# EAGLE design cert3d_rev1 (EAGLE 9.3.2)
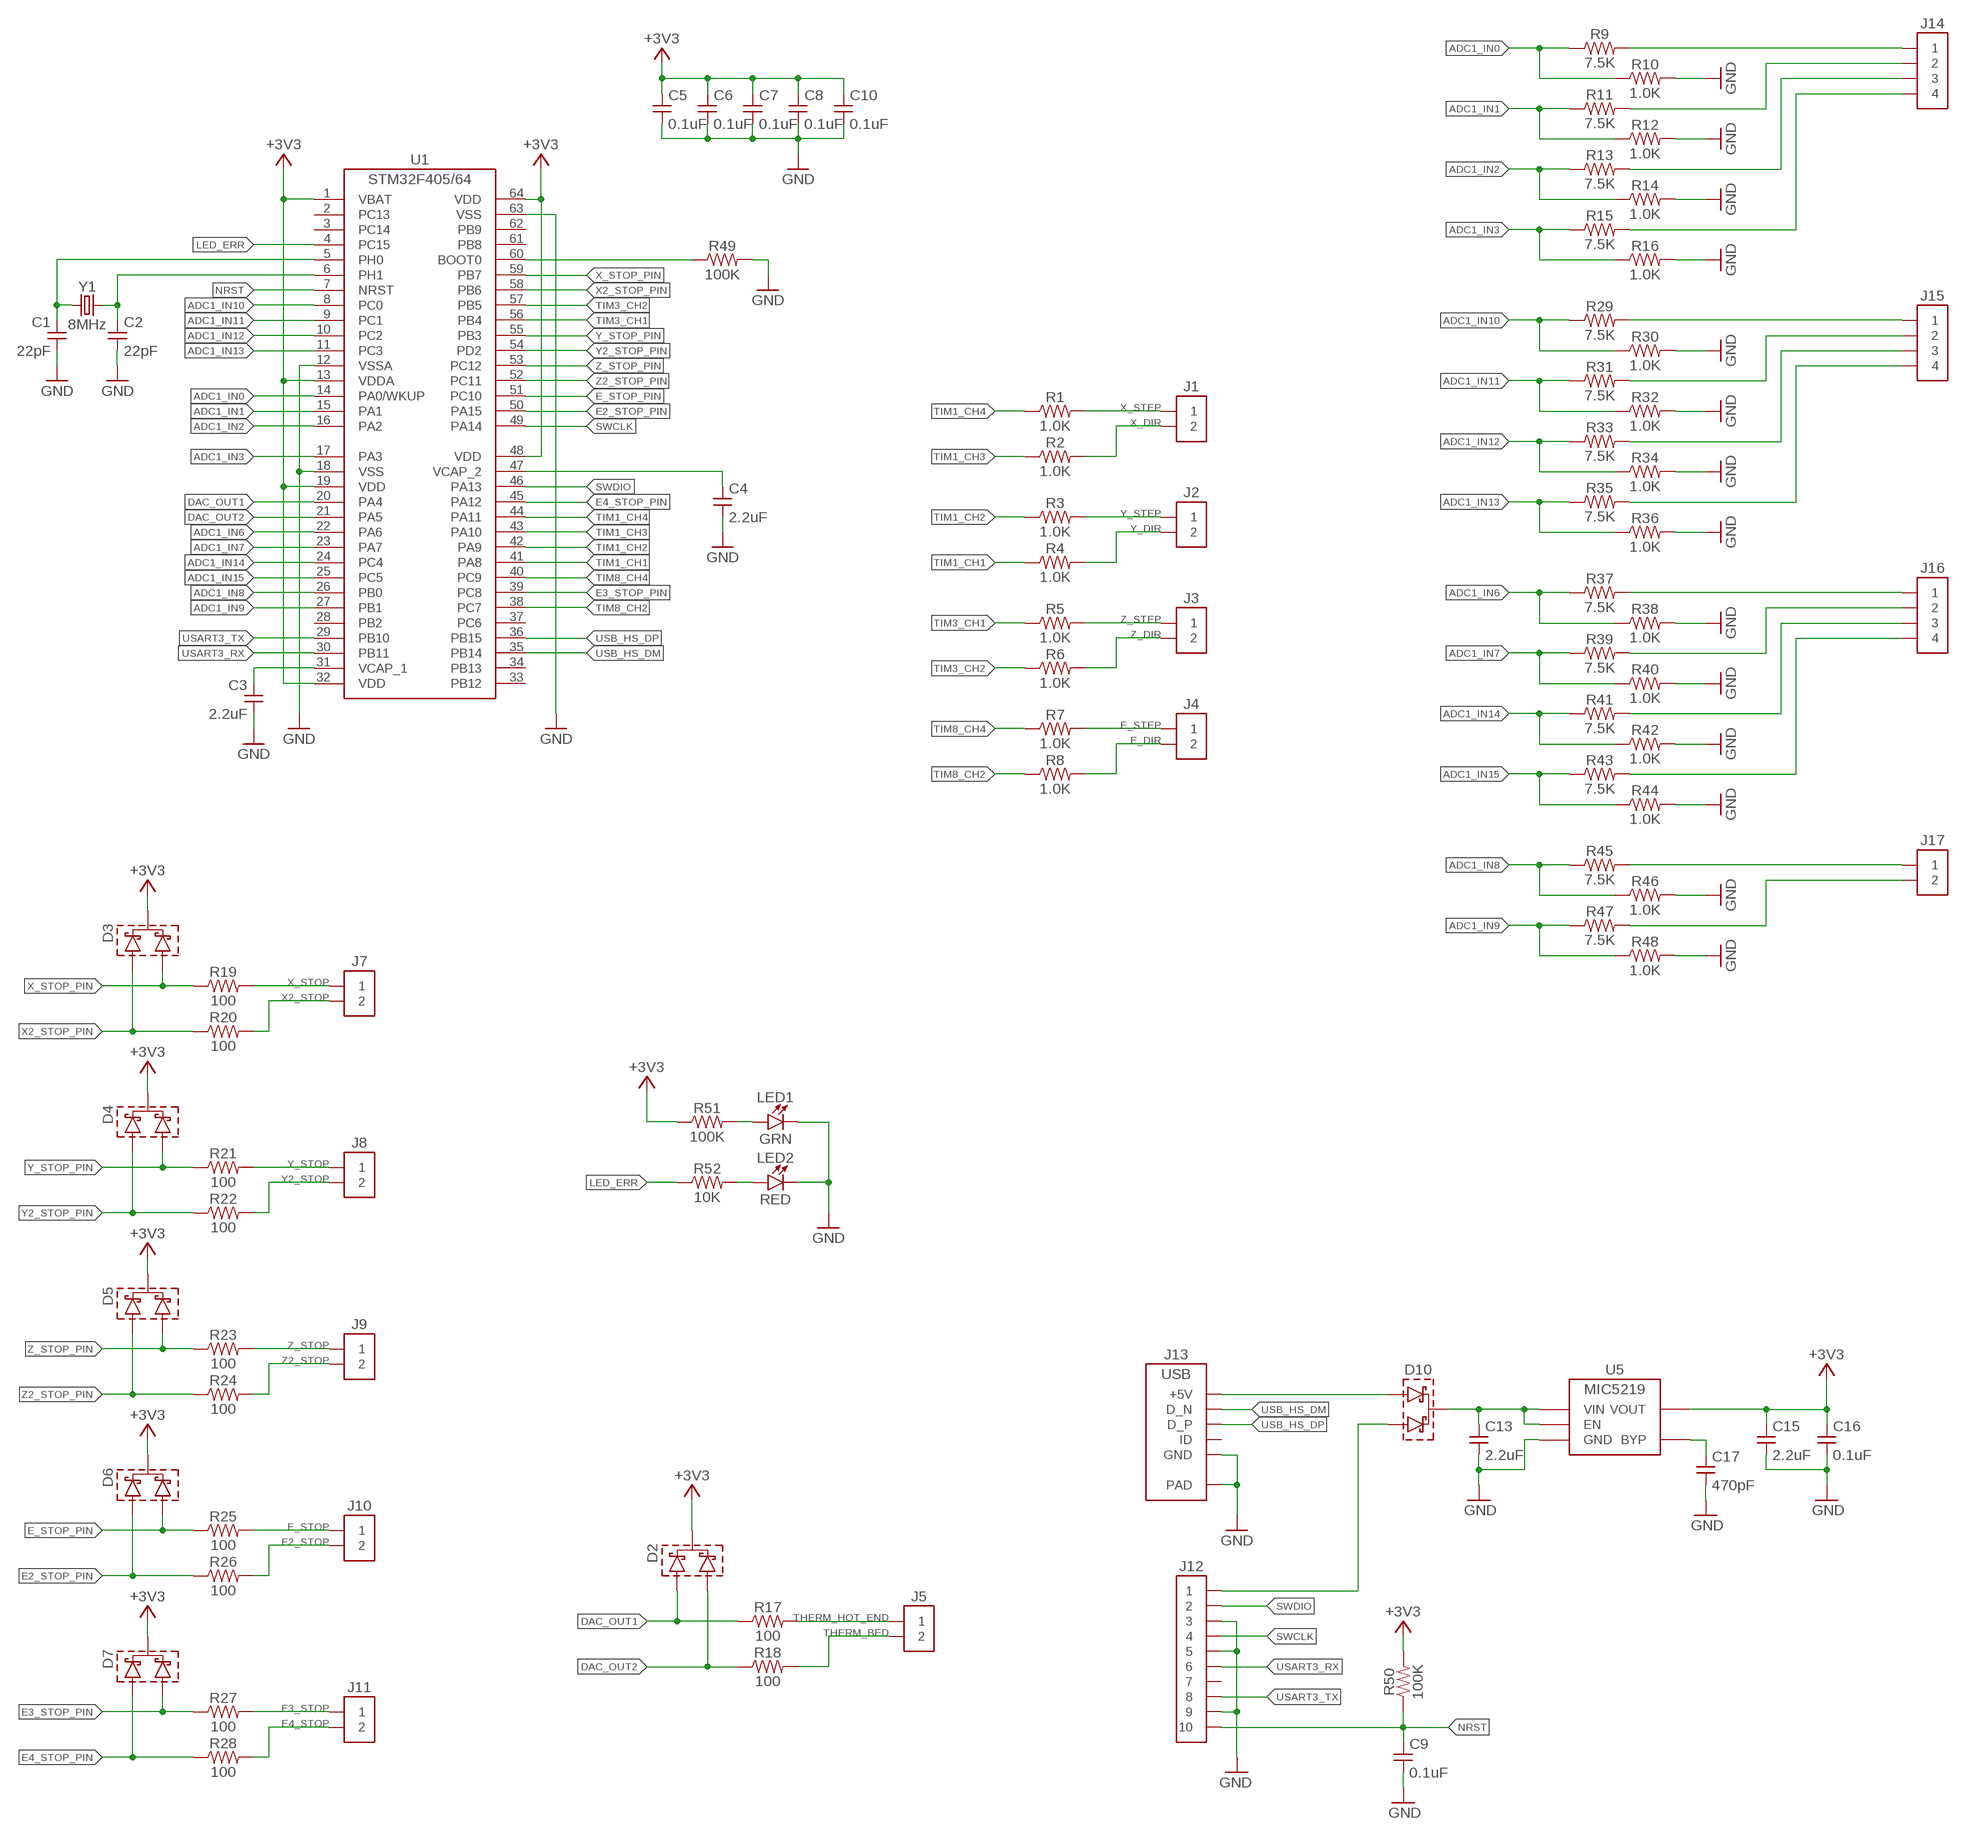
[diagram p0: schematic, sheet 1]

## Parts
C1  22pF  C_USC0805-5MIL  [C0805-5MIL]
C2  22pF  C_USC0805-5MIL  [C0805-5MIL]
C3  2.2uF  C_USC0805-5MIL  [C0805-5MIL]
C4  2.2uF  C_USC0805-5MIL  [C0805-5MIL]
C5  0.1uF  C_USC0805-5MIL  [C0805-5MIL]
C6  0.1uF  C_USC0805-5MIL  [C0805-5MIL]
C7  0.1uF  C_USC0805-5MIL  [C0805-5MIL]
C8  0.1uF  C_USC0805-5MIL  [C0805-5MIL]
C9  0.1uF  C_USC0805-5MIL  [C0805-5MIL]
C10  0.1uF  C_USC0805-5MIL  [C0805-5MIL]
C13  2.2uF  C_USC0805-5MIL  [C0805-5MIL]
C15  2.2uF  C_USC0805-5MIL  [C0805-5MIL]
C16  0.1uF  C_USC0805-5MIL  [C0805-5MIL]
C17  470pF  C_USC0805-5MIL  [C0805-5MIL]
D2  SCHOTTKY_DUAL_CCBAT54C  [SOT23-3]
D3  SCHOTTKY_DUAL_CCBAT54C  [SOT23-3]
D4  SCHOTTKY_DUAL_CCBAT54C  [SOT23-3]
D5  SCHOTTKY_DUAL_CCBAT54C  [SOT23-3]
D6  SCHOTTKY_DUAL_CCBAT54C  [SOT23-3]
D7  SCHOTTKY_DUAL_CCBAT54C  [SOT23-3]
D10  SCHOTTKY_DUAL_CCBAT54C  [SOT23-3]
J1  CONN2TSW-S  [SAM-TSW-102-XX-X-S]
J2  CONN2TSW-S  [SAM-TSW-102-XX-X-S]
J3  CONN2TSW-S  [SAM-TSW-102-XX-X-S]
J4  CONN2TSW-S  [SAM-TSW-102-XX-X-S]
J5  CONN2TSW-S  [SAM-TSW-102-XX-X-S]
J7  CONN2TSW-S  [SAM-TSW-102-XX-X-S]
J8  CONN2TSW-S  [SAM-TSW-102-XX-X-S]
J9  CONN2TSW-S  [SAM-TSW-102-XX-X-S]
J10  CONN2TSW-S  [SAM-TSW-102-XX-X-S]
J11  CONN2TSW-S  [SAM-TSW-102-XX-X-S]
J12  CONN10CNC-3220-10-0100-00  [CNC-3220-10-0100-00]
J13  USB-5PINTOPVIA  [HIR-ZX62R-B-5P-VIAS]
J14  CONN4TSW-S  [SAM-TSW-104-XX-X-S]
J15  CONN4TSW-S  [SAM-TSW-104-XX-X-S]
J16  CONN4TSW-S  [SAM-TSW-104-XX-X-S]
J17  CONN2TSW-S  [SAM-TSW-102-XX-X-S]
LED1  GRN  LEDCHIPLED0805-SMALL  [CHIPLED0805-SMALL]
LED2  RED  LEDCHIPLED0805-SMALL  [CHIPLED0805-SMALL]
R1  1.0K  R_US0805R  [RES0805R]
R2  1.0K  R_US0805R  [RES0805R]
R3  1.0K  R_US0805R  [RES0805R]
R4  1.0K  R_US0805R  [RES0805R]
R5  1.0K  R_US0805R  [RES0805R]
R6  1.0K  R_US0805R  [RES0805R]
R7  1.0K  R_US0805R  [RES0805R]
R8  1.0K  R_US0805R  [RES0805R]
R9  7.5K  R_USRES0805-5MIL  [RES0805R-5MIL]
R10  1.0K  R_USRES0805-5MIL  [RES0805R-5MIL]
R11  7.5K  R_USRES0805-5MIL  [RES0805R-5MIL]
R12  1.0K  R_USRES0805-5MIL  [RES0805R-5MIL]
R13  7.5K  R_USRES0805-5MIL  [RES0805R-5MIL]
R14  1.0K  R_USRES0805-5MIL  [RES0805R-5MIL]
R15  7.5K  R_USRES0805-5MIL  [RES0805R-5MIL]
R16  1.0K  R_USRES0805-5MIL  [RES0805R-5MIL]
R17  100  R_USRES0805-5MIL  [RES0805R-5MIL]
R18  100  R_USRES0805-5MIL  [RES0805R-5MIL]
R19  100  R_USRES0805-5MIL  [RES0805R-5MIL]
R20  100  R_USRES0805-5MIL  [RES0805R-5MIL]
R21  100  R_USRES0805-5MIL  [RES0805R-5MIL]
R22  100  R_USRES0805-5MIL  [RES0805R-5MIL]
R23  100  R_USRES0805-5MIL  [RES0805R-5MIL]
R24  100  R_USRES0805-5MIL  [RES0805R-5MIL]
R25  100  R_USRES0805-5MIL  [RES0805R-5MIL]
R26  100  R_USRES0805-5MIL  [RES0805R-5MIL]
R27  100  R_USRES0805-5MIL  [RES0805R-5MIL]
R28  100  R_USRES0805-5MIL  [RES0805R-5MIL]
R29  7.5K  R_USRES0805-5MIL  [RES0805R-5MIL]
R30  1.0K  R_USRES0805-5MIL  [RES0805R-5MIL]
R31  7.5K  R_USRES0805-5MIL  [RES0805R-5MIL]
R32  1.0K  R_USRES0805-5MIL  [RES0805R-5MIL]
R33  7.5K  R_USRES0805-5MIL  [RES0805R-5MIL]
R34  1.0K  R_USRES0805-5MIL  [RES0805R-5MIL]
R35  7.5K  R_USRES0805-5MIL  [RES0805R-5MIL]
R36  1.0K  R_USRES0805-5MIL  [RES0805R-5MIL]
R37  7.5K  R_USRES0805-5MIL  [RES0805R-5MIL]
R38  1.0K  R_USRES0805-5MIL  [RES0805R-5MIL]
R39  7.5K  R_USRES0805-5MIL  [RES0805R-5MIL]
R40  1.0K  R_USRES0805-5MIL  [RES0805R-5MIL]
R41  7.5K  R_USRES0805-5MIL  [RES0805R-5MIL]
R42  1.0K  R_USRES0805-5MIL  [RES0805R-5MIL]
R43  7.5K  R_USRES0805-5MIL  [RES0805R-5MIL]
R44  1.0K  R_USRES0805-5MIL  [RES0805R-5MIL]
R45  7.5K  R_USRES0805-5MIL  [RES0805R-5MIL]
R46  1.0K  R_USRES0805-5MIL  [RES0805R-5MIL]
R47  7.5K  R_USRES0805-5MIL  [RES0805R-5MIL]
R48  1.0K  R_USRES0805-5MIL  [RES0805R-5MIL]
R49  100K  R_USRES0805-5MIL  [RES0805R-5MIL]
R50  100K  R_USRES0805-5MIL  [RES0805R-5MIL]
R51  100K  R_USRES0805-5MIL  [RES0805R-5MIL]
R52  10K  R_USRES0805-5MIL  [RES0805R-5MIL]
U1  STM32F405/64  [LQFP64-10X10MM]
U5  MIC5219  [SOT23-5]
Y1  8MHz  CRYSTALHC49US  [HC49US]

## Nets
+3V3: C5.1 C6.1 C7.1 C8.1 C10.1 C15.1 C16.1 D2.3(C) D3.3(C) D4.3(C) D5.3(C) D6.3(C) D7.3(C) R50.2 R51.1 U1.1(VBAT) U1.13(VDDA) U1.19(VDD) U1.32(VDD) U1.48(VDD) U1.64(VDD) U5.5(VOUT)
ADC1_IN0: R9.1 R10.1 U1.14(PA0/WKUP)
ADC1_IN1: R11.1 R12.1 U1.15(PA1)
ADC1_IN2: R13.1 R14.1 U1.16(PA2)
ADC1_IN3: R15.1 R16.1 U1.17(PA3)
ADC1_IN6: R37.1 R38.1 U1.22(PA6)
ADC1_IN7: R39.1 R40.1 U1.23(PA7)
ADC1_IN8: R45.1 R46.1 U1.26(PB0)
ADC1_IN9: R47.1 R48.1 U1.27(PB1)
ADC1_IN10: R29.1 R30.1 U1.8(PC0)
ADC1_IN11: R31.1 R32.1 U1.9(PC1)
ADC1_IN12: R33.1 R34.1 U1.10(PC2)
ADC1_IN13: R35.1 R36.1 U1.11(PC3)
ADC1_IN14: R41.1 R42.1 U1.24(PC4)
ADC1_IN15: R43.1 R44.1 U1.25(PC5)
DAC_OUT1: D2.1(A1) R17.1 U1.20(PA4)
DAC_OUT2: D2.2(A2) R18.1 U1.21(PA5)
E2_STOP: J10.2 R26.2
E2_STOP_PIN: D6.1(A1) R26.1 U1.50(PA15)
E3_STOP: J11.1 R27.2
E3_STOP_PIN: D7.2(A2) R27.1 U1.39(PC8)
E4_STOP: J11.2 R28.2
E4_STOP_PIN: D7.1(A1) R28.1 U1.45(PA12)
E_DIR: J4.2 R8.2
E_STEP: J4.1 R7.2
E_STOP: J10.1 R25.2
E_STOP_PIN: D6.2(A2) R25.1 U1.51(PC10)
GND: C1.2 C2.2 C3.2 C4.2 C5.2 C6.2 C7.2 C8.2 C9.2 C10.2 C13.2 C15.2 C16.2 C17.2 J12.3 J12.5 J12.9 J13.5(GND) J13.PAD@1(PAD) J13.PAD@2(PAD) J13.PAD@3(PAD) J13.PAD@4(PAD) J13.PAD@5(PAD) J13.PAD@6(PAD) J13.PAD@7(PAD) J13.PAD@8(PAD) J13.PAD@9(PAD) J13.PAD@10(PAD) J13.PAD@11(PAD) J13.PAD@12(PAD) LED1.C LED2.C R10.2 R12.2 R14.2 R16.2 R30.2 R32.2 R34.2 R36.2 R38.2 R40.2 R42.2 R44.2 R46.2 R48.2 R49.2 U1.12(VSSA) U1.18(VSS) U1.63(VSS) U5.2(GND)
LED_ERR: R52.1 U1.4(PC15)
N$1: C2.1 U1.6(PH1) Y1.2
N$2: C1.1 U1.5(PH0) Y1.1
N$3: J14.2 R11.2
N$4: C4.1 U1.47(VCAP_2)
N$5: J14.1 R9.2
N$6: C3.1 U1.31(VCAP_1)
N$7: J14.3 R13.2
N$8: J14.4 R15.2
N$9: D10.2(A2) J12.1
N$10: C13.1 D10.3(C) U5.1(VIN) U5.3(EN)
N$11: J15.1 R29.2
N$12: D10.1(A1) J13.1(+5V)
N$13: J15.2 R31.2
N$14: J15.3 R33.2
N$15: J15.4 R35.2
N$16: J16.1 R37.2
N$17: J16.2 R39.2
N$18: J16.3 R41.2
N$19: J16.4 R43.2
N$20: J17.1 R45.2
N$21: J17.2 R47.2
N$22: R49.1 U1.60(BOOT0)
N$23: LED2.A R52.2
N$24: LED1.A R51.2
N$33: C17.1 U5.4(BYP)
NRST: C9.1 J12.10 R50.1 U1.7(NRST)
SWCLK: J12.4 U1.49(PA14)
SWDIO: J12.2 U1.46(PA13)
THERM_BED: J5.2 R18.2
THERM_HOT_END: J5.1 R17.2
TIM1_CH1: R4.1 U1.41(PA8)
TIM1_CH2: R3.1 U1.42(PA9)
TIM1_CH3: R2.1 U1.43(PA10)
TIM1_CH4: R1.1 U1.44(PA11)
TIM3_CH1: R5.1 U1.56(PB4)
TIM3_CH2: R6.1 U1.57(PB5)
TIM8_CH2: R8.1 U1.38(PC7)
TIM8_CH4: R7.1 U1.40(PC9)
USART3_RX: J12.6 U1.30(PB11)
USART3_TX: J12.8 U1.29(PB10)
USB_HS_DM: J13.2(D_N) U1.35(PB14)
USB_HS_DP: J13.3(D_P) U1.36(PB15)
X2_STOP: J7.2 R20.2
X2_STOP_PIN: D3.1(A1) R20.1 U1.58(PB6)
X_DIR: J1.2 R2.2
X_STEP: J1.1 R1.2
X_STOP: J7.1 R19.2
X_STOP_PIN: D3.2(A2) R19.1 U1.59(PB7)
Y2_STOP: J8.2 R22.2
Y2_STOP_PIN: D4.1(A1) R22.1 U1.54(PD2)
Y_DIR: J2.2 R4.2
Y_STEP: J2.1 R3.2
Y_STOP: J8.1 R21.2
Y_STOP_PIN: D4.2(A2) R21.1 U1.55(PB3)
Z2_STOP: J9.2 R24.2
Z2_STOP_PIN: D5.1(A1) R24.1 U1.52(PC11)
Z_DIR: J3.2 R6.2
Z_STEP: J3.1 R5.2
Z_STOP: J9.1 R23.2
Z_STOP_PIN: D5.2(A2) R23.1 U1.53(PC12)
Unconnected: J12.7 J13.4(ID) U1.2(PC13) U1.3(PC14) U1.28(PB2) U1.33(PB12) U1.34(PB13) U1.37(PC6) U1.61(PB8) U1.62(PB9)

## Library data of the parts
C1 C2 = kcl_passives:C_US; PN: 885012007053
C3 C4 = kcl_passives:C_US; PN: C0805C225K3RAC7800
C5-C10 C16 C17 = kcl_passives:C_US; PN: C0805C104K5RACTU
C13 C15 = kcl_passives:C_US; PN: C0805C225K8RACTU
D2-D7 D10 = kcl_passives:SCHOTTKY_DUAL_CC; PN: BAT54CLT1G
J1-J5 J7-J11 J17 = kcl_connectors_auto:CONN2; PN: TSW-102-07-F-S
J12 = kcl_connectors:CONN10; PN: 3220-10-0100-00
J13 = kcl_connectors:USB-5PIN; PN: ZX62R-B-5P(30)
J14-J16 = kcl_connectors_auto:CONN4; PN: TSW-104-07-F-S
LED1 = kcl_passives:LED; PN: 150080GS75000
LED2 = kcl_passives:LED; PN: 150080RS75000
R1-R8 R10 R12 R14 R16 R30 R32 R34 R36 R38 R40 R42 R44 R46 R48 = kcl_passives:R_US; PN: CRCW08051K00FKEA
R9 R11 R13 R15 R29 R31 R33 R35 R37 R39 R41 R43 R45 R47 = kcl_passives:R_US; PN: CRCW08057K50FKEA
R17-R28 = kcl_passives:R_US; PN: CRCW0805100RFKEA
R49-R51 = kcl_passives:R_US; PN: CRCW0805100KFKEA
R52 = kcl_passives:R_US; PN: CRCW080510K0FKEA
U1 = kcl_ics:STM32F405/64; PN: STM32F405RGT6‎
U5 = kcl_ics:MIC5219; PN: MIC5323-3.3YD5-TR
Y1 = kcl_passives:CRYSTAL: Crystal; PN: FC4STCBMF8.0-BAG200

## Net classes
0 default: width 0.254 mm

## Board
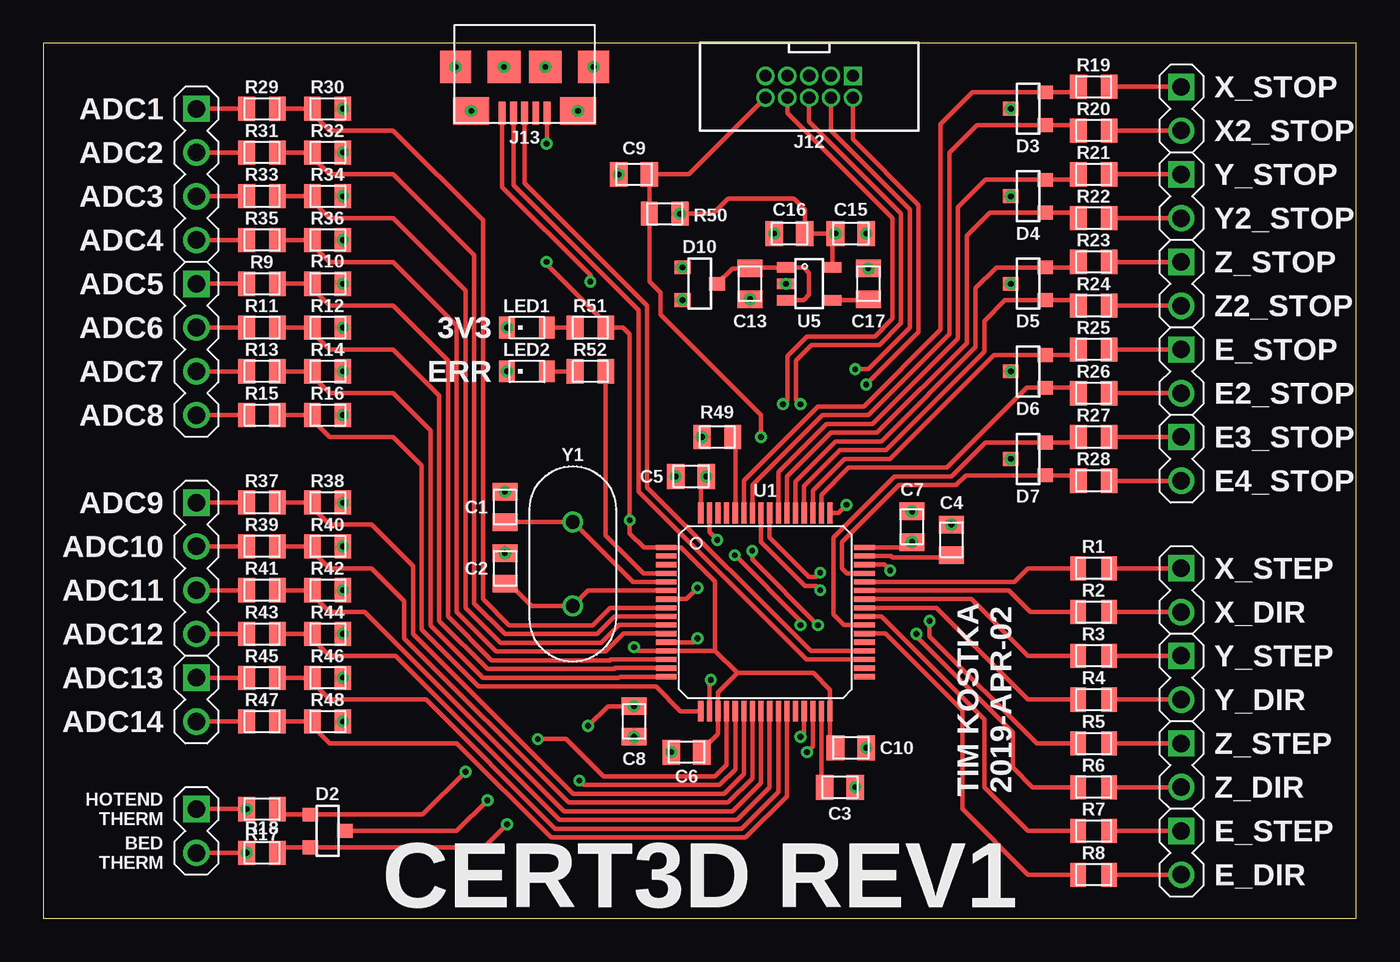
[diagram p1: board, top side]
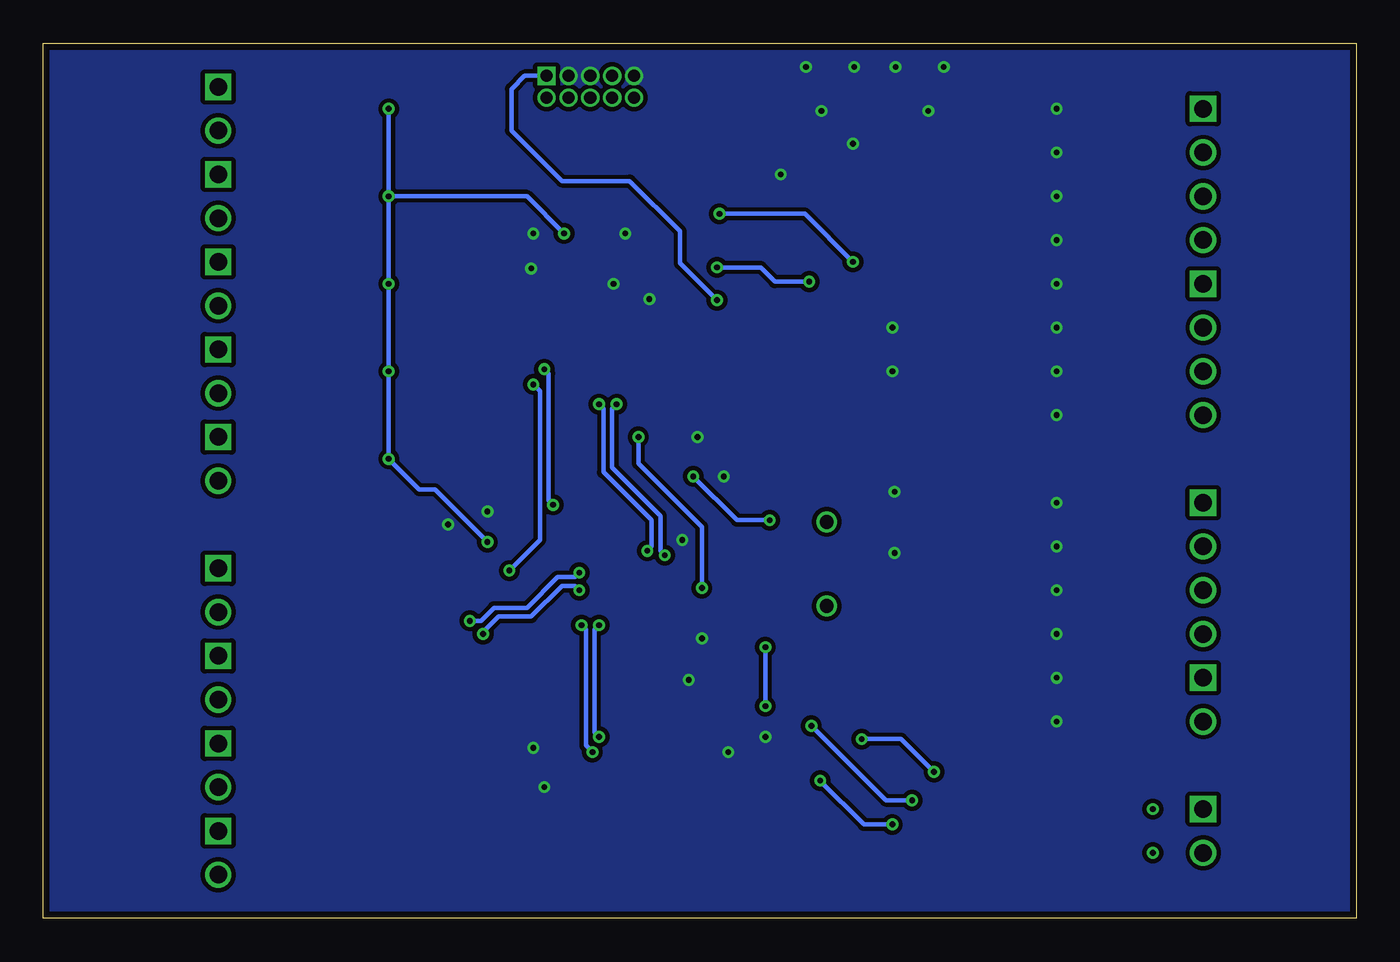
[diagram p2: board, bottom side, seen from below]

Size 76.2 x 50.8 mm. Coordinates in mm from the lower left corner, seen from the top.
Outline: 0,0 76.2,0 76.2,50.8 0,50.8 0,0
Copper layers (1*16): Top 0.0356mm / dielectric 1.5011mm / Bottom 0.0356mm
Design rules "oshpark-2layer *": minimum track width 6mil, minimum drill 13mil, track to track 6mil, track to pad 6mil, pad to pad 6mil, via to via 6mil, smd to smd 6mil, copper to edge 15mil, drill to drill 6mil, minimum pad ring 7mil, minimum via ring 7mil, stop-mask expansion 4mil, vias tented up to drill 13mil, thermal gap 10mil

### Footprints (pad centres in the part's own frame; a part is rotated, then mirrored left to right if it is on the bottom)
C0805-5MIL = smd 1.016 x 1.448: 1 -0.889,0; 2 0.889,0
SOT23-3 = smd 0.9 x 0.8: 1 -1,0.95; 2 -1,-0.95; 3 1,0
SAM-TSW-102-XX-X-S = drill 1.016 square: 1 -1.27,0 | drill 1.016: 2 1.27,0
CNC-3220-10-0100-00 = drill 0.7 square: 1 -0.635,2.54 | drill 0.7: 2 0.635,2.54; 3 -0.635,1.27; 4 0.635,1.27; 5 -0.635,0; 6 0.635,0; 7 -0.635,-1.27; 8 0.635,-1.27; 9 -0.635,-2.54; 10 0.635,-2.54
HIR-ZX62R-B-5P-VIAS = smd 0.4 x 1.35: 1 -1.3,0; 2 -0.65,0; 3 0,0; 4 0.65,0; 5 1.3,0 | smd 2.1 x 1.6: PAD@1 3.1,0.125; PAD@2 -3.1,0.125 | smd 1.8 x 1.9: PAD@3 4,2.675; PAD@4 -4,2.675 | smd 1.9 x 1.9: PAD@5 1.2,2.675; PAD@6 -1.2,2.675 | drill 0.33: PAD@7 -3.1,0.125; PAD@8 -4,2.675; PAD@9 -1.2,2.675; PAD@10 1.2,2.675; PAD@11 4,2.675; PAD@12 3.1,0.125
SAM-TSW-104-XX-X-S = drill 1.016 square: 1 -3.81,0 | drill 1.016: 2 -1.27,0; 3 1.27,0; 4 3.81,0
CHIPLED0805-SMALL = smd 0.9 x 1.25: A 1.15,0; C -1.15,0
RES0805R = smd 0.9 x 1.4: 1 -0.9,0; 2 0.9,0
RES0805R-5MIL = smd 0.965 x 1.4: 1 -0.889,0; 2 0.889,0
LQFP64-10X10MM = smd 1.2 x 0.3: 1 -5.75,3.75; 2 -5.75,3.25; 3 -5.75,2.75; 4 -5.75,2.25; 5 -5.75,1.75; 6 -5.75,1.25; 7 -5.75,0.75; 8 -5.75,0.25; 9 -5.75,-0.25; 10 -5.75,-0.75; 11 -5.75,-1.25; 12 -5.75,-1.75; 13 -5.75,-2.25; 14 -5.75,-2.75; 15 -5.75,-3.25; 16 -5.75,-3.75; 33 5.75,-3.75; 34 5.75,-3.25; 35 5.75,-2.75; 36 5.75,-2.25; 37 5.75,-1.75; 38 5.75,-1.25; 39 5.75,-0.75; 40 5.75,-0.25; 41 5.75,0.25; 42 5.75,0.75; 43 5.75,1.25; 44 5.75,1.75; 45 5.75,2.25; 46 5.75,2.75; 47 5.75,3.25; 48 5.75,3.75 | smd 0.3 x 1.2: 17 -3.75,-5.75; 18 -3.25,-5.75; 19 -2.75,-5.75; 20 -2.25,-5.75; 21 -1.75,-5.75; 22 -1.25,-5.75; 23 -0.75,-5.75; 24 -0.25,-5.75; 25 0.25,-5.75; 26 0.75,-5.75; 27 1.25,-5.75; 28 1.75,-5.75; 29 2.25,-5.75; 30 2.75,-5.75; 31 3.25,-5.75; 32 3.75,-5.75; 49 3.75,5.75; 50 3.25,5.75; 51 2.75,5.75; 52 2.25,5.75; 53 1.75,5.75; 54 1.25,5.75; 55 0.75,5.75; 56 0.25,5.75; 57 -0.25,5.75; 58 -0.75,5.75; 59 -1.25,5.75; 60 -1.75,5.75; 61 -2.25,5.75; 62 -2.75,5.75; 63 -3.25,5.75; 64 -3.75,5.75
SOT23-5 = smd 1.05 x 0.6: 1 -1.35,0.95; 2 -1.35,0; 3 -1.35,-0.95; 4 1.35,-0.95; 5 1.35,0.95
HC49US = drill 0.8: 1 -2.44,0; 2 2.44,0

### Placement (x,y rotation side)
C1  26.8,23.88 90 top
C2  26.8,20.32 90 top
C3  46.23,7.62 0 top
C4  52.7,21.97 90 top
C5  37.59,25.65 180 top
C6  37.34,9.65 180 top
C7  50.42,22.73 90 top
C8  34.29,11.43 270 top
C9  34.29,43.18 180 top
C10  46.86,9.91 0 top
C13  41.02,36.83 270 top
C15  46.86,39.75 0 top
C16  43.31,39.75 180 top
C17  47.88,36.83 90 top
D2  16.51,5.08 0 top
D3  57.15,46.99 180 top
D4  57.15,41.91 180 top
D5  57.15,36.83 180 top
D6  57.15,31.75 180 top
D7  57.15,26.67 180 top
D10  38.1,36.83 0 top
J1  66.04,19.05 270 top
J2  66.04,13.97 270 top
J3  66.04,8.89 270 top
J4  66.04,3.81 270 top
J5  8.89,5.08 270 top
J7  66.04,46.99 270 top
J8  66.04,41.91 270 top
J9  66.04,36.83 270 top
J10  66.04,31.75 270 top
J11  66.04,26.67 270 top
J12  44.45,48.26 270 top
J13  27.94,46.74 0 top
J14  8.89,33.02 270 top
J15  8.89,43.18 270 top
J16  8.89,20.32 270 top
J17  8.89,12.7 270 top
LED1  28.07,34.29 0 top
LED2  28.07,31.75 0 top
R1  60.96,20.32 0 top
R2  60.96,17.78 0 top
R3  60.96,15.24 0 top
R4  60.96,12.7 0 top
R5  60.96,10.16 0 top
R6  60.96,7.62 0 top
R7  60.96,5.08 0 top
R8  60.96,2.54 0 top
R9  12.7,36.83 180 top
R10  16.51,36.83 0 top
R11  12.7,34.29 180 top
R12  16.51,34.29 0 top
R13  12.7,31.75 180 top
R14  16.51,31.75 0 top
R15  12.7,29.21 180 top
R16  16.51,29.21 0 top
R17  12.7,6.35 180 top
R18  12.7,3.81 180 top
R19  60.96,48.26 0 top
R20  60.96,45.72 0 top
R21  60.96,43.18 0 top
R22  60.96,40.64 0 top
R23  60.96,38.1 0 top
R24  60.96,35.56 0 top
R25  60.96,33.02 0 top
R26  60.96,30.48 0 top
R27  60.96,27.94 0 top
R28  60.96,25.4 0 top
R29  12.7,46.99 180 top
R30  16.51,46.99 0 top
R31  12.7,44.45 180 top
R32  16.51,44.45 0 top
R33  12.7,41.91 180 top
R34  16.51,41.91 0 top
R35  12.7,39.37 180 top
R36  16.51,39.37 0 top
R37  12.7,24.13 180 top
R38  16.51,24.13 0 top
R39  12.7,21.59 180 top
R40  16.51,21.59 0 top
R41  12.7,19.05 180 top
R42  16.51,19.05 0 top
R43  12.7,16.51 180 top
R44  16.51,16.51 0 top
R45  12.7,13.97 180 top
R46  16.51,13.97 0 top
R47  12.7,11.43 180 top
R48  16.51,11.43 0 top
R49  39.12,27.94 180 top
R50  36.07,40.89 0 top
R51  31.75,34.29 180 top
R52  31.75,31.75 180 top
U1  41.91,17.78 0 top
U5  44.45,36.83 0 top
Y1  30.73,20.57 270 top

### Tracks (layer width: path | path; a pad name or v marks a point on that pad's centre or on a via)
+3V3  (via drill 0.33)
  Top 0.254: v34.29,15.75 34.51,15.53 U1.13 38.99,15.53 | C6.1 38.23,9.78 39.16,10.71 U1.19 39.16,13.12 40.28,14.24 | U5.5 45.8,39.58 C15.1 C16.1 44.2,41.15 43.56,41.78 39.75,41.78 38.86,40.89 R50.2 | C10.1 45.66,10.22 U1.32 45.66,13.27 44.69,14.24 40.28,14.24 | U1.64 38.16,25.33 C5.1 | U1.48 50.1,21.53 C7.1 | 38.99,15.53 38.99,19.56 37.02,21.53 U1.1 34.86,21.53 34.04,22.35 v34.04,23.11 34.04,33.91 33.66,34.29 R51.1 32.64,34.54 29.21,37.97 v29.21,38.1 | 38.99,15.53 40.28,14.24 | C8.1 32.77,12.32 v31.62,11.18 | v25.78,6.86 24,5.08 D2.3
  Bottom 0.254: C8.1 v34.29,15.75 | D3.3 D4.3 | D4.3 D5.3 D6.3 D7.3 54.37,24.89 53.47,24.89 C7.1 | v31.62,11.18 27.3,6.86 v25.78,6.86 | C5.1 35.94,23.11 v34.04,23.11 | R50.2 32,40.89 v29.21,38.1 | C15.1 48.13,41.91 D4.3
  other vias: 34.29,12.32 56.15,46.99 56.15,41.91 56.15,36.83 56.15,31.75 56.15,26.67 50.42,21.84 38.48,25.65 36.96,40.89 45.97,39.75
ADC1_IN0
  Top 0.254: R9.1 R10.1 15.62,36.58 16.64,35.56 20.32,35.56 23.5,32.38 23.5,17.53 26.04,14.99 32.89,14.99 32.94,15.03 U1.14
ADC1_IN1
  Top 0.254: R11.1 R12.1 15.62,34.04 16.64,33.02 20.32,33.02 22.99,30.35 22.99,17.27 25.78,14.48 33.15,14.48 33.2,14.53 U1.15
ADC1_IN2
  Top 0.254: R13.1 R14.1 15.62,31.5 16.64,30.48 20.32,30.48 22.48,28.32 22.48,17.02 25.53,13.97 33.4,13.97 33.46,14.03 U1.16
ADC1_IN3
  Top 0.254: R15.1 R16.1 15.62,28.96 16.64,27.94 20.32,27.94 21.97,26.29 21.97,16.76 25.27,13.46 35.56,13.46 36.99,12.03 U1.17
ADC1_IN6
  Top 0.254: R37.1 R38.1 15.62,23.88 16.64,22.86 19.05,22.86 21.46,20.45 21.46,16.51 30.73,7.24 39.5,7.24 40.66,8.4 U1.22
ADC1_IN7
  Top 0.254: R39.1 R40.1 15.62,21.34 16.64,20.32 19.05,20.32 20.95,18.41 20.95,16.26 30.48,6.73 39.75,6.73 41.16,8.14 U1.23
ADC1_IN8
  Top 0.254: R45.1 R46.1 15.62,13.72 16.64,12.7 22.23,12.7 29.72,5.21 40.51,5.21 42.66,7.35 U1.26
ADC1_IN9
  Top 0.254: R47.1 R48.1 15.62,11.18 16.64,10.16 24,10.16 29.46,4.7 40.77,4.7 43.16,7.09 U1.27
ADC1_IN10
  Top 0.254: R29.1 R30.1 15.62,46.74 16.64,45.72 20.32,45.72 25.53,40.51 25.53,18.54 27.05,17.02 31.88,17.02 32.89,18.03 U1.8
ADC1_IN11
  Top 0.254: R31.1 R32.1 15.62,44.2 16.64,43.18 20.32,43.18 25.02,38.48 25.02,18.29 26.8,16.51 32.13,16.51 33.15,17.53 U1.9
ADC1_IN12
  Top 0.254: R33.1 R34.1 15.62,41.66 16.64,40.64 20.32,40.64 24.51,36.45 24.51,18.03 26.54,16 32.38,16 33.41,17.03 U1.10
ADC1_IN13
  Top 0.254: R35.1 R36.1 15.62,39.12 16.64,38.1 20.32,38.1 24,34.42 24,17.78 26.29,15.49 32.64,15.49 33.67,16.53 U1.11
ADC1_IN14
  Top 0.254: R41.1 R42.1 15.62,18.8 16.64,17.78 18.67,17.78 30.23,6.22 40.01,6.22 41.66,7.88 U1.24
ADC1_IN15
  Top 0.254: R43.1 R44.1 15.62,16.26 16.64,15.24 20.45,15.24 29.97,5.71 40.26,5.71 42.16,7.62 U1.25
DAC_OUT1  (via drill 0.33)
  Top 0.254: U1.20 39.66,8.93 38.99,8.26 32.51,8.26 30.35,10.41 v28.7,10.41 | R17.1 13.91,6.03 D2.1 22.03,6.03 v24.51,8.51
  Bottom 0.254: v28.7,10.41 26.42,10.41 v24.51,8.51
DAC_OUT2  (via drill 0.33)
  Top 0.254: U1.21 40.16,8.66 39.24,7.75 31.37,7.75 v31.11,8 | R18.1 13.91,4.13 D2.2 25.59,4.13 v26.92,5.46
  Bottom 0.254: v31.11,8 28.57,5.46 v26.92,5.46
E2_STOP
  Top 0.254: J10.2 R26.2
E2_STOP_PIN
  Top 0.254: R26.1 59.75,30.8 D6.1 57.09,30.8 52.45,26.16 46.74,26.16 45.16,24.59 U1.50
E3_STOP
  Top 0.254: R27.2 J11.1
E3_STOP_PIN
  Top 0.254: R27.1 59.75,27.62 D7.2 54.67,27.62 52.7,25.65 49.4,25.65 45.85,22.1 45.85,17.65 46.47,17.03 U1.39
E4_STOP
  Top 0.254: J11.2 R28.2
E4_STOP_PIN
  Top 0.254: R28.1 59.75,25.72 D7.1 53.53,25.72 52.96,25.15 49.66,25.15 46.35,21.84 46.35,20.32 46.65,20.03 U1.45
E_DIR
  Top 0.254: J4.2 R8.2
E_STEP
  Top 0.254: J4.1 R7.2
E_STOP
  Top 0.254: R25.2 J10.1
E_STOP_PIN
  Top 0.254: R25.1 59.75,32.7 D6.2 55.18,32.7 49.15,26.67 46.48,26.67 44.66,24.85 U1.51
GND  (via drill 0.33)
  Top 0.254: U1.12 37.75,16.03 v37.97,16.26 | U1.18 38.66,13.77 v38.73,13.84 | U1.63 38.66,22.43 v39.12,21.97 | J13.5 29.24,44.99 v29.21,44.96
  other vias: 17.4,46.99 17.4,44.45 17.4,41.91 17.4,39.37 17.4,36.83 17.4,34.29 17.4,31.75 17.4,29.21 26.92,31.75 26.92,34.29 33.4,43.18 41.02,35.94 43.1,36.83 47.88,37.72 47.75,39.75 42.42,39.75 47.75,9.91 47.12,7.62 36.45,9.65 34.29,10.54 26.8,24.77 26.8,21.21 36.7,25.65 38.23,27.94 52.7,22.86 50.42,23.62 17.4,19.05 17.4,21.59 17.4,24.13 17.4,16.51 17.4,13.97 17.4,11.43
  pour Bottom (isolate 0.254, rank 2, no thermals): -2.54,53.34 78.74,53.34 78.74,-2.54 -2.54,-2.54
LED_ERR
  Top 0.254: U1.4 34.83,20.03 32.64,22.23 R52.1
N$1
  Top 0.254: U1.6 31.63,19.03 Y1.2 28.35,18.13 27.05,19.43 C2.1
N$2
  Top 0.254: U1.5 34.22,19.53 Y1.1 26.82,23.01 C1.1
N$3
  Top 0.254: J14.2 R11.2
N$4
  Top 0.254: U1.47 49.2,21.03 49.28,20.95 52.58,20.95 C4.1
N$5
  Top 0.254: R9.2 J14.1
N$6
  Top 0.254: U1.31 45.16,7.8 C3.1
N$7
  Top 0.254: R13.2 J14.3
N$8
  Top 0.254: J14.4 R15.2
N$9  (via drill 0.33)
  Bottom 0.254: J12.1 48.26,48.9 49.02,48.13 49.02,45.72 46.1,42.8 42.16,42.8 39.24,39.88 39.24,38.02 D10.2
  other vias: 37.1,35.88
N$10
  Top 0.254: D10.3 39.99,37.72 C13.1 41.08,37.78 U5.1 44.13,37.78 44.45,37.47 44.45,36.2 44.13,35.88 U5.3
N$11
  Top 0.254: J15.1 R29.2
N$12  (via drill 0.33)
  Top 0.254: J13.1 26.64,42.45 31.75,37.34 v31.75,36.96
  Bottom 0.254: v31.75,36.96 33.74,36.96 34.56,37.78 D10.1
  other vias: 37.1,37.78
N$13
  Top 0.254: R31.2 J15.2
N$14
  Top 0.254: J15.3 R33.2
N$15
  Top 0.254: R35.2 J15.4
N$16
  Top 0.254: J16.1 R37.2
N$17
  Top 0.254: R39.2 J16.2
N$18
  Top 0.254: R41.2 J16.3
N$19
  Top 0.254: R43.2 J16.4
N$20
  Top 0.254: R45.2 J17.1
N$21
  Top 0.254: J17.2 R47.2
N$22
  Top 0.254: U1.60 40.16,27.79 R49.1
N$23
  Top 0.254: R52.2 LED2.A
N$24
  Top 0.254: R51.2 LED1.A
N$33
  Top 0.254: U5.4 47.82,35.88 C17.1
NRST  (via drill 0.33)
  Top 0.254: U1.7 37.33,18.53 v37.97,19.18 | v41.66,27.94 41.66,29.21 35.81,35.05 35.81,36.32 35.18,36.96 R50.1 C9.1 37.47,43.18 J12.10
  Bottom 0.254: v37.97,19.18 37.97,22.73 41.66,26.42 v41.66,27.94
SWCLK  (via drill 0.33)
  Top 0.254: U1.49 46.14,23.53 v46.61,24 | v47.12,31.88 47.88,31.88 50.29,34.29 50.29,41.15 45.72,45.72 J12.4
  Bottom 0.254: v46.61,24 46.86,24.26 46.86,31.62 v47.12,31.88
SWDIO  (via drill 0.33)
  Top 0.254: U1.46 48.81,20.53 v49.15,20.19 | v47.75,30.99 50.8,34.04 50.8,41.4 46.99,45.21 J12.2
  Bottom 0.254: v49.15,20.19 47.37,21.97 47.37,30.61 v47.75,30.99
THERM_BED  (via drill 0.33)
  Top 0.254: J5.2 R18.2
  other vias: 11.81,3.81
THERM_HOT_END  (via drill 0.33)
  Top 0.254: R17.2 J5.1
  other vias: 11.81,6.35
TIM1_CH1
  Top 0.254: R4.1 57.15,12.7 51.82,18.03 U1.41
TIM1_CH2
  Top 0.254: R3.1 57.15,15.24 53.86,18.53 U1.42
TIM1_CH3
  Top 0.254: U1.43 56.03,19.03 57.28,17.78 R2.1
TIM1_CH4
  Top 0.254: U1.44 56.36,19.53 57.15,20.32 R1.1
TIM3_CH1  (via drill 0.33)
  Top 0.254: R5.1 57.66,10.16 51.44,16.38 v51.44,17.27 | U1.56 42.16,22.1 44.45,19.81 44.83,19.81 v45.09,20.07
  Bottom 0.254: v45.09,20.07 45.34,19.81 46.35,19.81 48.13,18.03 50.04,18.03 50.8,17.27 v51.44,17.27
TIM3_CH2  (via drill 0.33)
  Top 0.254: v50.67,16.51 50.67,16.38 56.26,10.79 56.26,8.76 57.4,7.62 R6.1 | U1.57 41.66,21.84 44.2,19.3 44.83,19.3 v45.09,19.05
  Bottom 0.254: v45.09,19.05 45.34,19.3 46.1,19.3 47.88,17.53 49.78,17.53 50.67,16.64 v50.67,16.51
TIM8_CH2
  Top 0.254: R8.1 57.15,2.54 53.34,6.35 53.34,12.06 48.88,16.53 U1.38
TIM8_CH4
  Top 0.254: U1.40 48.64,17.53 54.61,11.56 54.61,7.62 57.15,5.08 R7.1
USART3_RX  (via drill 0.33)
  Top 0.254: U1.30 44.66,9.99 v44.32,9.65 | J12.6 44.45,46.23 49.78,40.89 49.78,34.54 48.51,33.27 44.58,33.27 43.69,32.38 43.69,30.1 v43.94,29.84 | v44.96,17.02 41.15,20.83 v41.15,21.34
  Bottom 0.254: v43.94,29.84 43.69,29.59 43.69,25.91 40.89,23.11 40.89,21.59 v41.15,21.34 | v44.32,9.65 44.7,10.03 44.7,16.76 v44.96,17.02
USART3_TX  (via drill 0.33)
  Top 0.254: U1.29 44.16,10.76 v43.94,10.54 | J12.8 43.18,46.74 49.28,40.64 49.28,34.8 48.26,33.78 44.32,33.78 43.18,32.64 43.18,30.1 v42.93,29.84 | v43.94,17.02 43.94,17.27 v40.13,21.08
  Bottom 0.254: v42.93,29.84 43.18,29.59 43.18,26.16 40.39,23.37 40.39,21.34 v40.13,21.08 | v43.94,10.54 44.2,10.79 44.2,16.76 v43.94,17.02
USB_HS_DM
  Top 0.254: J13.2 27.29,42.56 34.54,35.31 34.54,24.77 44.28,15.03 U1.35
USB_HS_DP
  Top 0.254: J13.3 27.94,42.67 35.05,35.56 35.05,25.02 44.54,15.53 U1.36
X2_STOP
  Top 0.254: J7.2 R20.2
X2_STOP_PIN
  Top 0.254: R20.1 59.75,46.04 D3.1 54.17,46.04 52.58,44.45 52.58,33.91 47.88,29.21 45.21,29.21 41.16,25.16 U1.58
X_DIR
  Top 0.254: J1.2 R2.2
X_STEP
  Top 0.254: R1.2 J1.1
X_STOP
  Top 0.254: R19.2 J7.1
X_STOP_PIN
  Top 0.254: R19.1 59.75,47.94 D3.2 53.91,47.94 52.07,46.1 52.07,34.16 47.62,29.72 44.96,29.72 40.66,25.42 U1.59
Y2_STOP
  Top 0.254: J8.2 R22.2
Y2_STOP_PIN
  Top 0.254: R22.1 59.75,40.96 D4.1 54.93,40.96 53.59,39.62 53.59,33.4 48.39,28.19 45.72,28.19 43.16,25.63 U1.54
Y_DIR
  Top 0.254: J2.2 R4.2
Y_STEP
  Top 0.254: R3.2 J2.1
Y_STOP
  Top 0.254: R21.2 J8.1
Y_STOP_PIN
  Top 0.254: R21.1 59.75,42.86 D4.2 54.67,42.86 53.09,41.27 53.09,33.66 48.13,28.7 45.47,28.7 42.66,25.9 U1.55
Z2_STOP
  Top 0.254: J9.2 R24.2
Z2_STOP_PIN
  Top 0.254: R24.1 59.75,35.88 D5.1 55.82,35.88 54.61,34.67 54.61,32.89 48.9,27.18 46.23,27.18 44.16,25.11 U1.52
Z_DIR
  Top 0.254: J3.2 R6.2
Z_STEP
  Top 0.254: J3.1 R5.2
Z_STOP
  Top 0.254: R23.2 J9.1
Z_STOP_PIN
  Top 0.254: R23.1 59.75,37.78 D5.2 55.31,37.78 54.1,36.58 54.1,33.15 48.64,27.69 45.97,27.69 43.66,25.37 U1.53

### Text on the board
tPlace: X_STOP | ADC1 | X2_STOP | ADC2 | Y_STOP | ADC3 | Y2_STOP | ADC4 | Z_STOP | ADC5 | Z2_STOP | ADC6 | 3V3 | E_STOP | ADC7 | ERR | E2_STOP | ADC8 | E3_STOP | E4_STOP | ADC9 | ADC10 | X_STEP | ADC11 | X_DIR | ADC12 | Y_STEP | ADC13 | TIM KOSTKA / 2019-APR-02 | Y_DIR | ADC14 | Z_STEP | Z_DIR | HOTEND / THERM | E_STEP | BED / THERM | CERT3D REV1 | E_DIR